# EasyEDA Pro project 2022-SS-ZT-2.eprj

# Schematic EDA_LQ_13P_P278
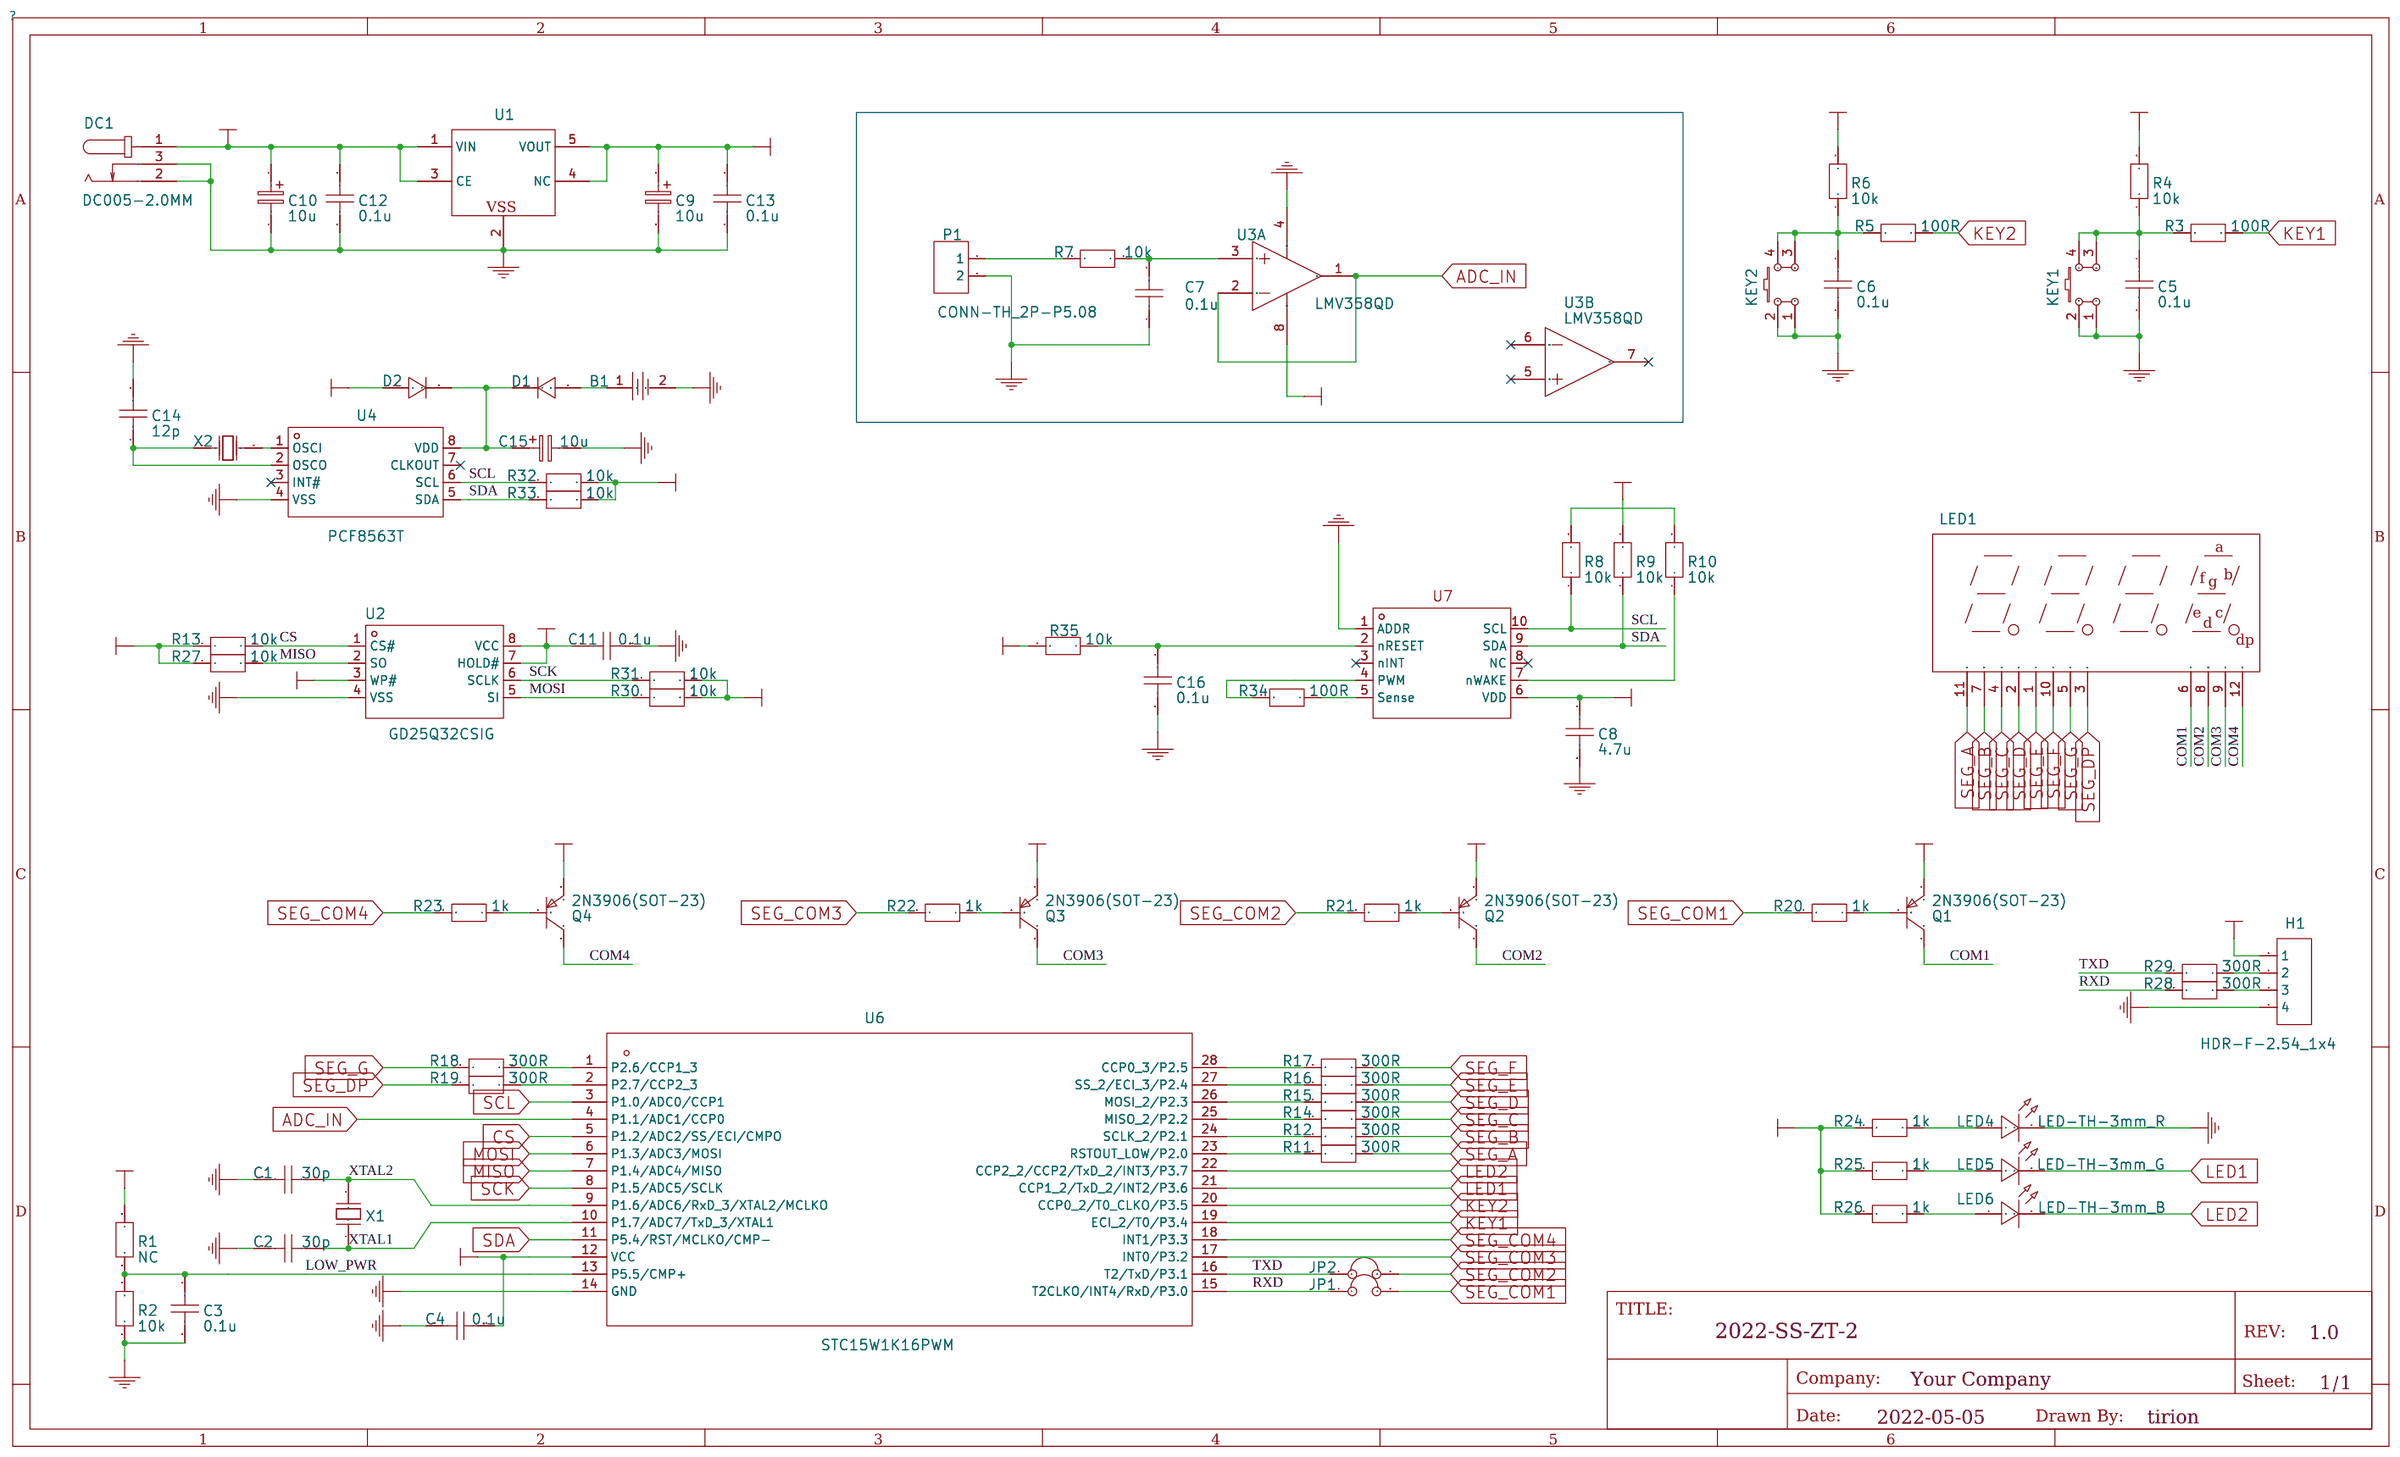
[diagram p0: schematic sheet]

## Parts
B1  CR1220-2  [BAT-SMD_CR1220-2]
C1  30p  [C0805]
C2  30p  [C0805]
C3  0.1u  [C0805]
C4  0.1u  [C0805]
C5  0.1u  [C0805]
C6  0.1u  [C0805]
C7  0.1u  [C0805]
C8  4.7u  [C0805]
C9  10u  [CAP-D5.0×H5.5]
C10  10u  [CAP-D5.0×H5.5]
C11  0.1u  [C0805]
C12  0.1u  [C0805]
C13  0.1u  [C0805]
C14  12p  [C0805]
C15  10u  [CAP-D5.0×H5.5]
C16  0.1u  [C0805]
D1  1N4148  [DO-35_BD2.0-L4.2-P8.20-D0.5-RD]
D2  1N4148  [DO-35_BD2.0-L4.2-P8.20-D0.5-RD]
DC1  DC005-2.0MM  [DC-IN-TH_DC005]
H1  HDR-F-2.54_1x4  [HDR-F-2.54_1X4]
JP1  跳线  [JUMPER2]
JP2  跳线  [JUMPER2]
KEY1  K4-6×6_SMD  [KEY-SMD_4P-L6.0-W6.0-P3.90-LS10.0]
KEY2  K4-6×6_SMD  [KEY-SMD_4P-L6.0-W6.0-P3.90-LS10.0]
LED1  0.36寸4位数码管  [LED-SEG-TH_FJ5461AH]
LED4  LED-TH-3mm_R  [LED-TH_BD3.0_RED]
LED5  LED-TH-3mm_G  [LED-TH_BD3.0_GREEN]
LED6  LED-TH-3mm_B  [LED-TH_BD3.0_BLUE]
P1  CONN-TH_2P-P5.08  [CONN-TH_2P-P5.08]
Q1  2N3906(SOT-23)  [SOT-23-3_L2.9-W1.6-P1.90-LS2.8-TR-CW]
Q2  2N3906(SOT-23)  [SOT-23-3_L2.9-W1.6-P1.90-LS2.8-TR-CW]
Q3  2N3906(SOT-23)  [SOT-23-3_L2.9-W1.6-P1.90-LS2.8-TR-CW]
Q4  2N3906(SOT-23)  [SOT-23-3_L2.9-W1.6-P1.90-LS2.8-TR-CW]
R1  NC  [R0805]
R2  10k  [R0805]
R3  100R  [R0805]
R4  10k  [R0805]
R5  100R  [R0805]
R6  10k  [R0805]
R7  10k  [R0805]
R8  10k  [R0805]
R9  10k  [R0805]
R10  10k  [R0805]
R11  300R  [R0805]
R12  300R  [R0805]
R13  10k  [R0805]
R14  300R  [R0805]
R15  300R  [R0805]
R16  300R  [R0805]
R17  300R  [R0805]
R18  300R  [R0805]
R19  300R  [R0805]
R20  1k  [R0805]
R21  1k  [R0805]
R22  1k  [R0805]
R23  1k  [R0805]
R24  1k  [R0805]
R25  1k  [R0805]
R26  1k  [R0805]
R27  10k  [R0805]
R28  300R  [R0805]
R29  300R  [R0805]
R30  10k  [R0805]
R31  10k  [R0805]
R32  10k  [R0805]
R33  10k  [R0805]
R34  100R  [R0805]
R35  10k  [R0805]
U1  XC6210A252M  [SOT-25_L2.9-W1.6-P0.95-LS2.8-BL]
U2  GD25Q32CSIG  [SOP-8_L5.3-W5.3-P1.27-LS8.0-BL]
U3  LMV358QD  [SOIC-8_L4.9-W3.9-P1.27-LS6.0-BL]  (sections 1,2)
U4  PCF8563T  [SOIC-8_L5.0-W4.0-P1.27-LS6.0-BL]
U6  STC15W1K16PWM  [SOP-28_L17.9-W7.5-P1.27-LS10.3-BL]
U7  SOIC-10  [IC-10]
X1  12MHZ  [OSC-49U-1]
X2  32.768KHz  [XTAL-DT38]

## Library data of the parts
B1 = CR1220-2: Supplier: LCSC; Manufacturer: Q&amp;J; Supplier Part: C70381; JLCPCB Part Class: Extended Part
C1 C2 = 30p
C3-C7 C11-C13 C16 = 0.1u
C8 = 4.7u
C9 C10 C15 = 10u
C14 = 12p
D1 D2 = 1N4148: Supplier: LCSC; Supplier Part: C13769; Manufacturer: STMicroelectronics
DC1 = DC005-2.0MM: Supplier: LCSC; Manufacturer: SOFNG; Supplier Part: C111567
H1 = HDR-F-2.54_1x4: Supplier Part: C225501; Supplier: LCSC
JP1 JP2 = 跳线
KEY1 KEY2 = K2-6639SP-D4SC-04: Supplier Part: C191626; Supplier: LCSC; Manufacturer: 韩国韩荣
LED1 = FJ5461BH 纯红: Supplier: LCSC; Manufacturer: ReliaPro; Supplier Part: C38183
LED4 = 204-10SDRD/S530-A3-L: Manufacturer: EVERLIGHT(台湾亿光); Supplier Part: C84774; Supplier: LCSC
LED5 = 204-10SYGD/S530-E3: Manufacturer: EVERLIGHT(台湾亿光); Supplier Part: C85161
LED6 = 204-10SUBC/S400-A4: Manufacturer: EVERLIGHT(台湾亿光); Supplier Part: C86881; Supplier: LCSC
P1 = CONN-TH_2P-P5.08: Supplier: LCSC
Q1-Q4 = 2N3906S-RTK/PS: Supplier: LCSC; Manufacturer: KEC; Supplier Part: C147294
R1 = NC
R2 R4 R6-R10 R13 R27 R30-R33 R35 = 10k
R3 R5 R34 = 100R
R11 R12 R14-R19 R28 R29 = 300R
R20-R26 = 1k
U1 = XC6210A252M: Supplier: LCSC; Manufacturer: Torex Semicon
U2 = GD25Q32CSIG: Supplier: LCSC; Manufacturer: GigaDevice; Supplier Part: C79075; JLCPCB Part Class: Extended Part
U3 = LMV358QD: Supplier: LCSC; Supplier Part: C2859693; Manufacturer: TI(德州仪器); link: https://atta.szlcsc.comnull
U4 = PCF8563T/5,518: Supplier: LCSC; Manufacturer: NXP; Supplier Part: C7440; JLCPCB Part Class: Basic Part
U6 = STC15W1K16PWM: Supplier: LCSC; Manufacturer: STC; Supplier Part: C65670; JLCPCB Part Class: Extended Part
U7 = SOIC-10
X1 = X49UD12MSD2SC: Supplier Part: undefined; Supplier: LCSC; Manufacturer: LCSC
X2 = 6K832768F12UB: Supplier: LCSC; Supplier Part: C252404; Manufacturer: SHENZHEN CRYSTAL TECH

## Nets
GND: B1.2 C1.2 C2.2 C3.2 C4.2 C5.2 C6.2 C7.1 C8.2 C9.2 C10.2 C11.2 C12.2 C13.2 C14.1 C15.2 C16.2 DC1.2 DC1.3 H1.4 KEY1.1 KEY1.2 KEY2.1 KEY2.2 LED4.2 P1.2 R2.1 U1.2(VSS) U2.4(VSS) U3.4(GND) U4.4(VSS) U6.14(GND) U7.1(ADDR)
VDD: C4.1 C8.1 C9.1 C11.1 C13.1 D2.2 H1.1 Q1.1(E) Q2.1(E) Q3.1(E) Q4.1(E) R4.2 R6.2 R9.2 R13.1 R24.2 R25.2 R26.2 R27.1 R30.2 R31.2 R32.2 R33.2 R35.2 U1.4(NC) U1.5(VOUT) U2.3(WP#) U2.7(HOLD#) U2.8(VCC) U3.8(VCC+) U6.12(VCC) U7.6(VDD)
ADC_IN: U3.1(OUT) U3.2(1IN-) U6.4(P1.1/ADC1/CCP0)
COM1: LED1.6(DIG4) Q1.3(C)
COM2: LED1.8(DIG3) Q2.3(C)
COM3: LED1.9(DIG2) Q3.3(C)
COM4: LED1.12(DIG1) Q4.3(C)
CS: R13.2 U2.1(CS#) U6.5(P1.2/ADC2/SS/ECI/CMPO)
DC: C10.1 C12.1 DC1.1 R1.2 U1.1(VIN) U1.3(CE)
KEY1: R3.1 U6.19(ECI_2/T0/P3.4)
KEY2: R5.1 U6.20(CCP0_2/T0_CLKO/P3.5)
LED1: LED5.2 U6.21(CCP1_2/TxD_2/INT2/P3.6)
LED2: LED6.2 U6.22(CCP2_2/CCP2/TxD_2/INT3/P3.7)
LOW_PWR: C3.1 R1.1 R2.2 U6.13(P5.5/CMP+)
MISO: R27.2 U2.2(SO) U6.7(P1.4/ADC4/MISO)
MOSI: R30.1 U2.5(SI) U6.6(P1.3/ADC3/MOSI)
RXD: JP1.1 R28.2 U6.15(T2CLKO/INT4/RxD/P3.0)
SCK: R31.1 U2.6(SCLK) U6.8(P1.5/ADC5/SCLK)
SCL: R8.1 R32.1 U4.6(SCL) U6.3(P1.0/ADC0/CCP1) U7.10(SCL)
SDA: R9.1 R33.1 U4.5(SDA) U6.11(P5.4/RST/MCLKO/CMP-) U7.9(SDA)
SEG_A: LED1.11(A) R11.1
SEG_B: LED1.7(B) R12.1
SEG_C: LED1.4(C) R14.1
SEG_COM1: JP1.2 R20.2
SEG_COM2: JP2.2 R21.2
SEG_COM3: R22.2 U6.17(INT0/P3.2)
SEG_COM4: R23.2 U6.18(INT1/P3.3)
SEG_D: LED1.2(D) R15.1
SEG_DP: LED1.3(DP) R19.2
SEG_E: LED1.1(E) R16.1
SEG_F: LED1.10(F) R17.1
SEG_G: LED1.5(G) R18.2
TXD: JP2.1 R29.2 U6.16(T2/TxD/P3.1)
XTAL1: C2.1 U6.10(P1.7/ADC7/TxD_3/XTAL1) X1.1(OSC1)
XTAL2: C1.1 U6.9(P1.6/ADC6/RxD_3/XTAL2/MCLKO) X1.2(OSC2)
$1N209: C5.1 KEY1.3 KEY1.4 R3.2 R4.1
$1N230: C6.1 KEY2.3 KEY2.4 R5.2 R6.1
$1N364: R17.2 U6.28(CCP0_3/P2.5)
$1N365: R16.2 U6.27(SS_2/ECI_3/P2.4)
$1N366: R15.2 U6.26(MOSI_2/P2.3)
$1N367: R14.2 U6.25(MISO_2/P2.2)
$1N368: R12.2 U6.24(SCLK_2/P2.1)
$1N369: R11.2 U6.23(RSTOUT_LOW/P2.0)
$1N370: R19.1 U6.2(P2.7/CCP2_3)
$1N371: R18.1 U6.1(P2.6/CCP1_3)
$1N483: Q1.2(B) R20.1
$1N492: Q2.2(B) R21.1
$1N524: Q3.2(B) R22.1
$1N556: Q4.2(B) R23.1
$1N635: LED5.1 R25.1
$1N636: LED6.1 R26.1
$1N802: H1.3 R28.1
$1N805: H1.2 R29.1
$1N952: B1.1 D1.2
$1N955: C15.1 D1.1 D2.1 U4.8(VDD)
$1N968: U4.1(OSCI) X2.2(OSC2)
$1N969: C14.2 U4.2(OSCO) X2.1(OSC1)
$1N1047: LED4.1 R24.1
$1N1134: R34.1 U7.5(Sense)
$1N1144: R34.2 U7.4(PWM)
$1N1149: R8.2 R10.2
$1N1177: R10.1 U7.7(nWAKE)
$1N1209: C16.1 R35.1 U7.2(nRESET)
$1N3634: P1.1 R7.2
$1N3652: C7.2 R7.1 U3.3(1IN+)

Not connected (* = marked no-connect by the designer): U3 5(2IN+)* 6(2IN-)* 7(2OUT)*; U4 3(INT#)* 7(CLKOUT)*; U7 3(nINT)* 8(NC)*

# Board PCB
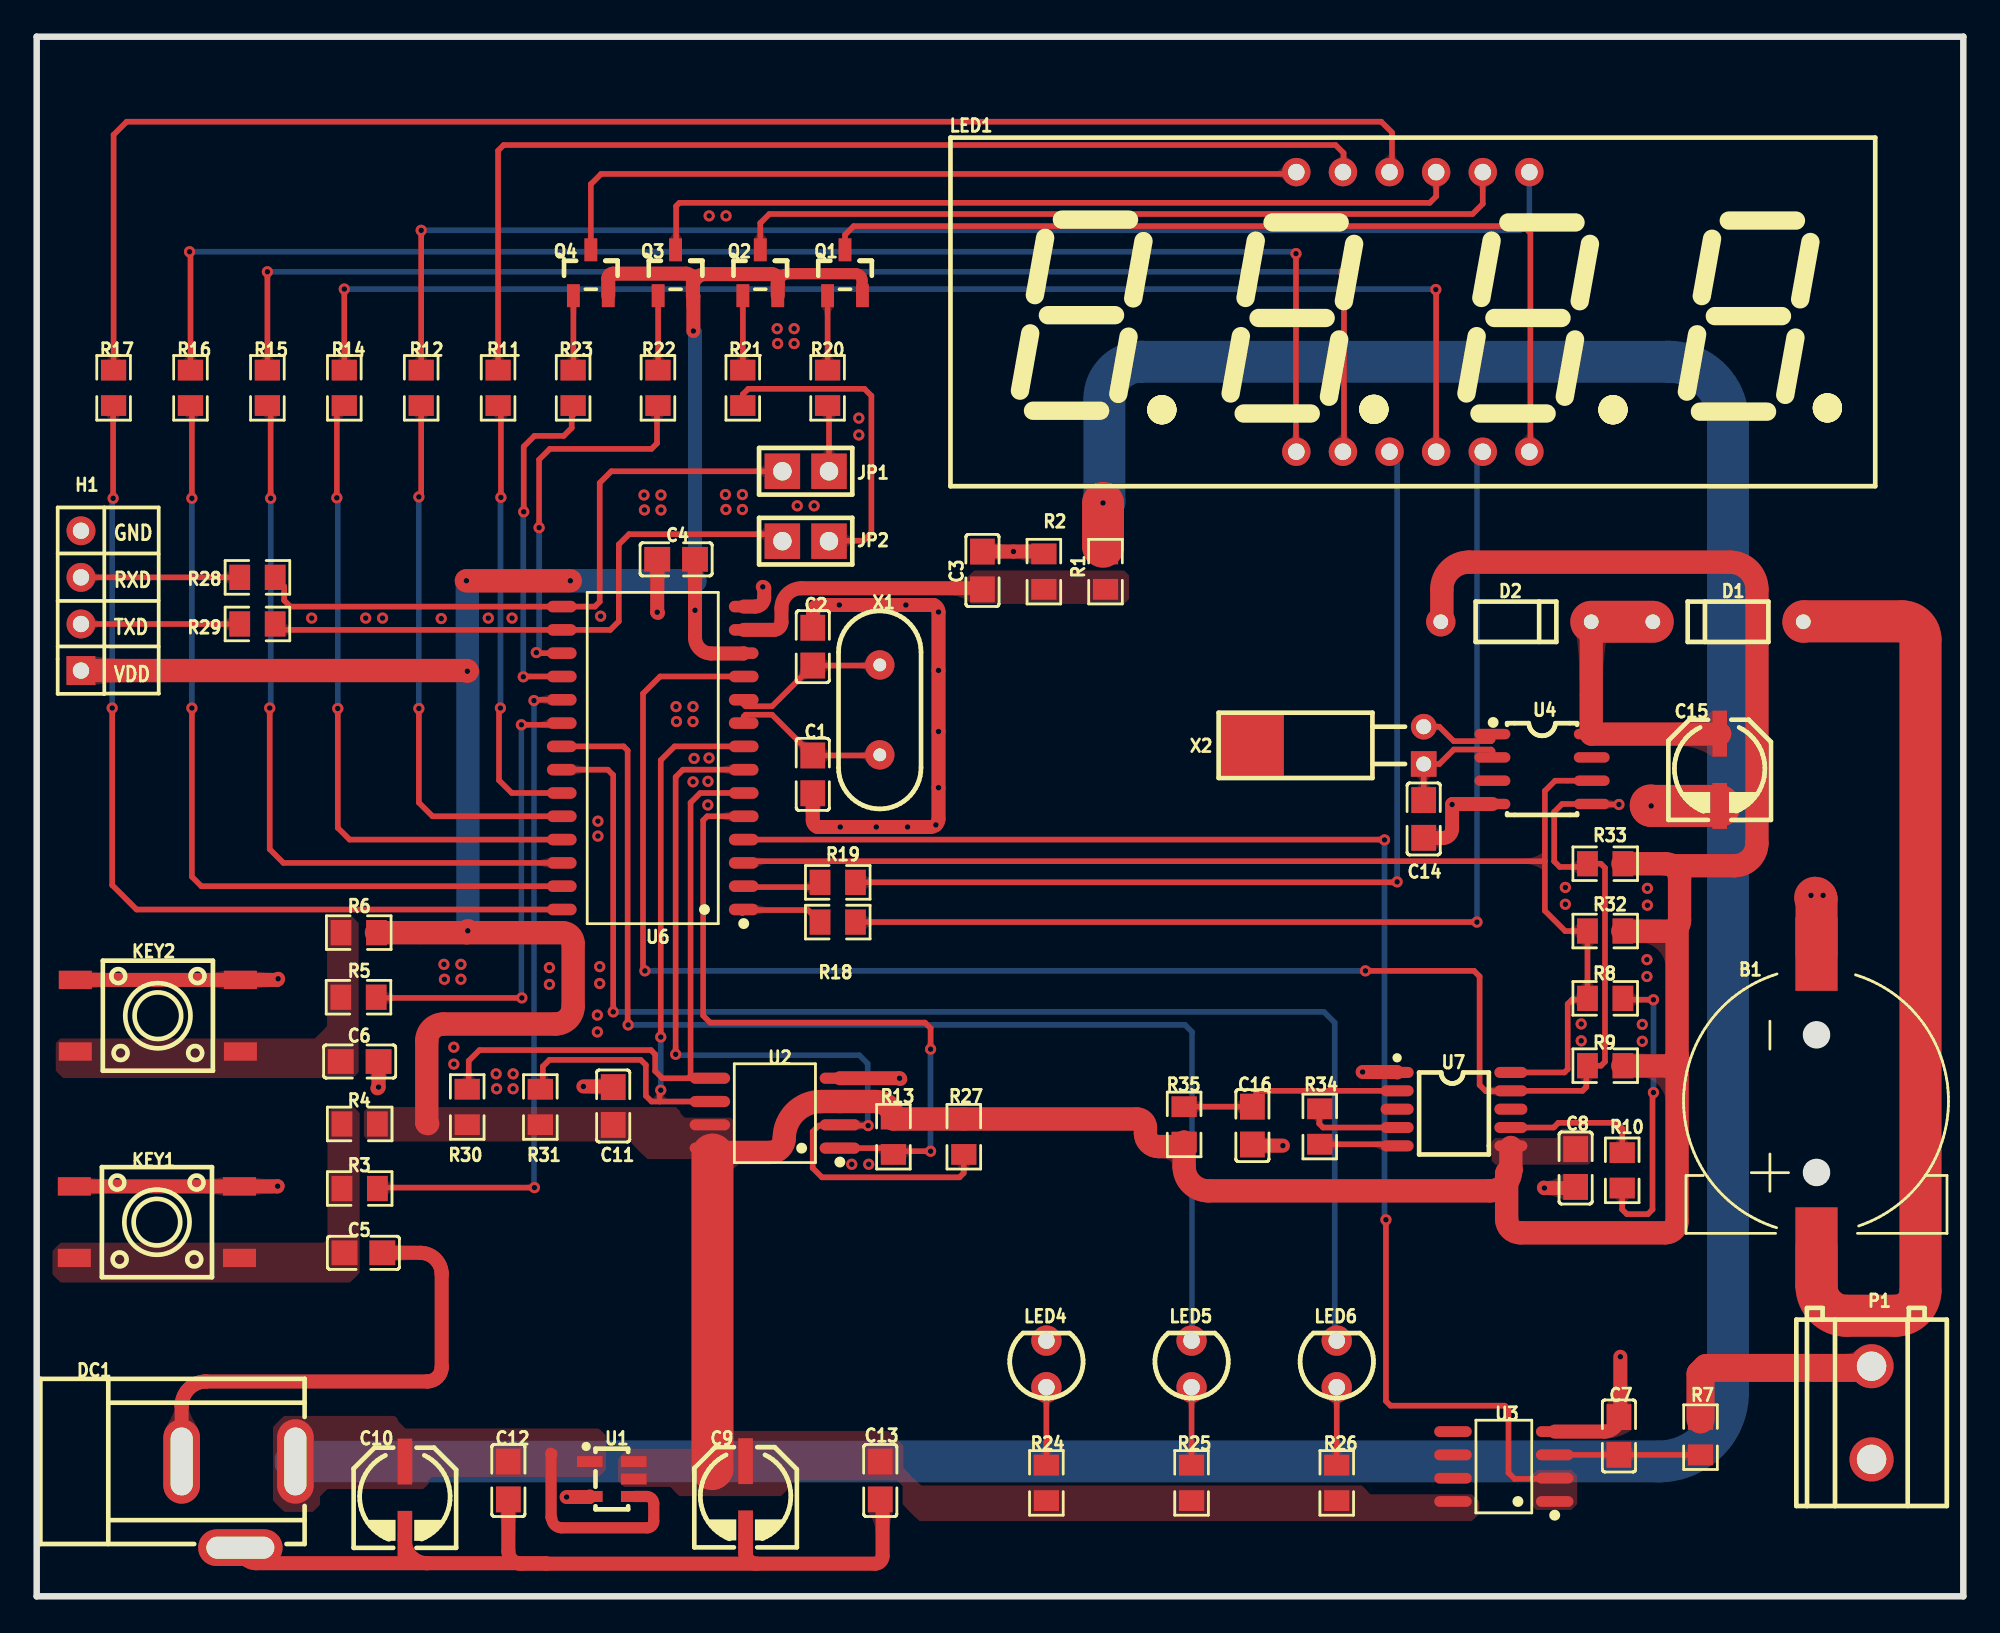
[diagram p1: board, top side]
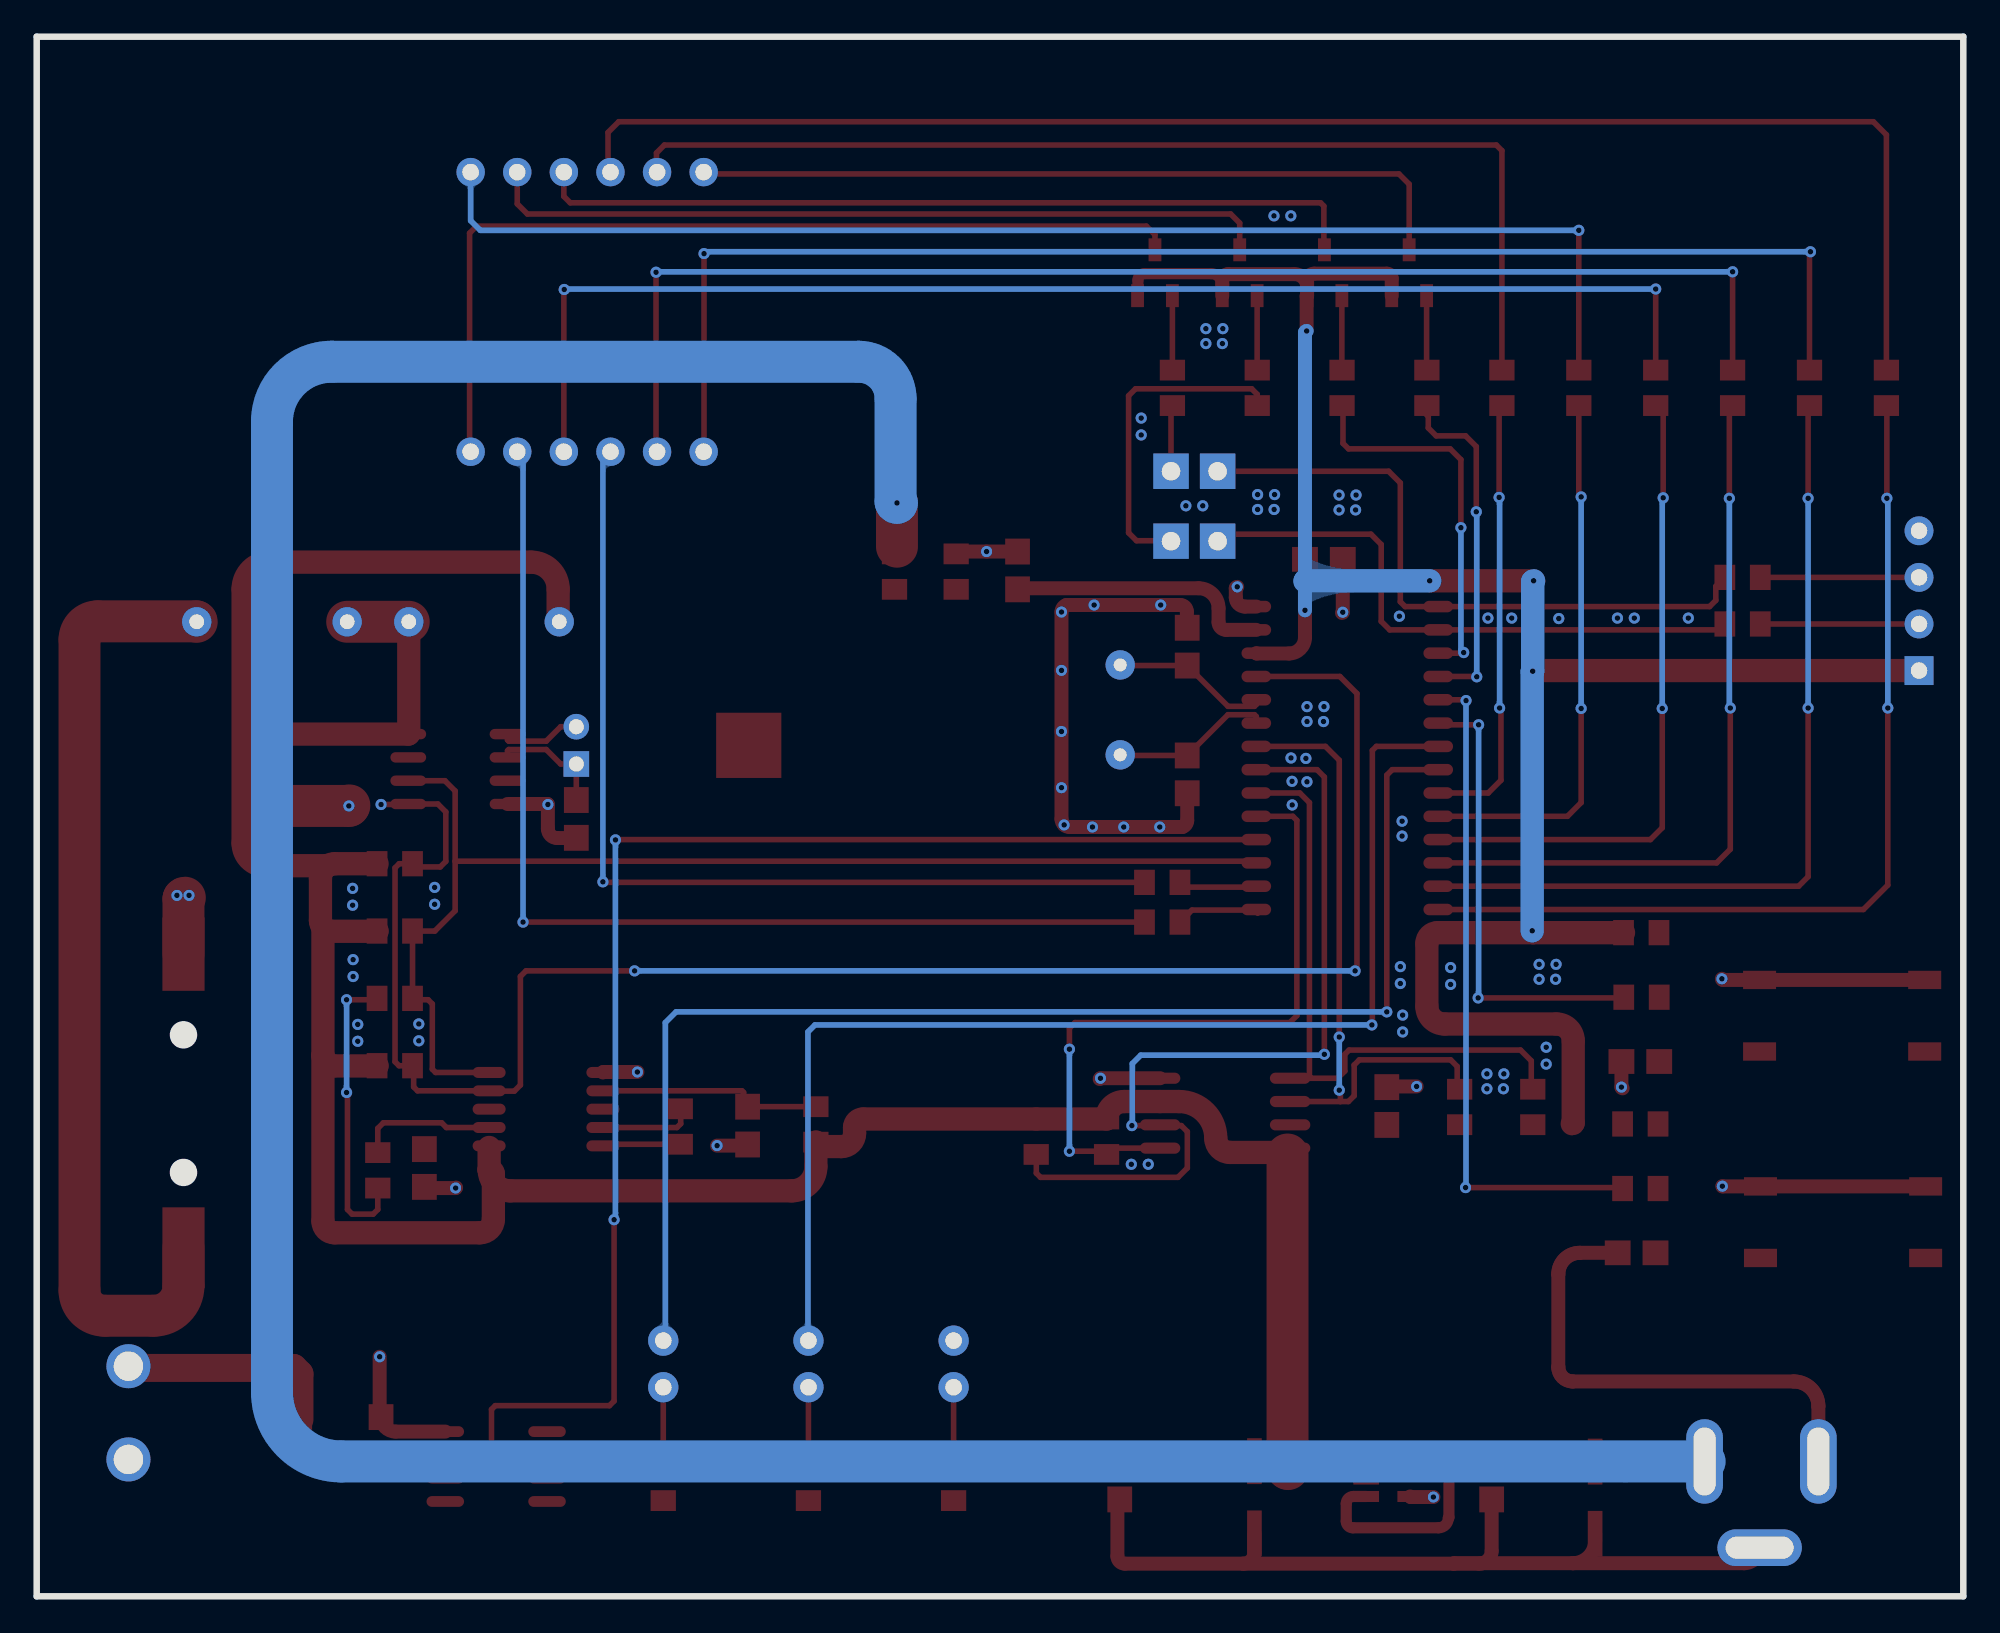
[diagram p2: board, bottom side, seen from below]

Outline 105 x 85 mm; copper layers: Top Layer, Bottom Layer. Coordinates in mm from the lower left corner of the outline.
Outline path: 0,85 105,85 105,0 0,0 0,85
Stack: Top Layer 0.035mm / Dielectric1 1.51mm FR4 er 4.5 / Bottom Layer 0.035mm

## Design rules (mm)
net XTAL2: DP2
net XTAL1: DP2
net $1N968: DP1
net $1N969: DP1
template: 用户自定义配置
spacing Default (default): track to track 0.152, other pairs 0 to 0.152
track width Default (default): min 0.305, default 0.305, max 25.4
track width PWR: min 0.305, default 0.61, max 2.54
differential pair differentialPair (default): width min 0.305, default 0.305, max 2.54; gap min 0.152, default 0.152
via Default (default): diameter min 0.61, default 0.61, max 100.025; hole min 0.305, default 0.305, max 59.995
net VDD uses PWR
net GND uses PWR
net DC uses PWR

## Placement (name value [footprint] x y rotation side)
B1  CR1220-2  [BAT-SMD_CR1220-2]  97 27 90 top
C1  30p  [C0805]  42.3 44.8 270 top
C2  30p  [C0805]  42.3 51.76 90 top
C3  0.1u  [C0805]  51.54 55.91 90 top
C4  0.1u  [C0805]  34.85 56.52 180 top
C5  0.1u  [C0805]  17.81 18.72 0 top
C6  0.1u  [C0805]  17.6 29.15 0 top
C7  0.1u  [C0805]  86.23 8.74 270 top
C8  4.7u  [C0805]  83.87 23.34 270 top
C9  10u  [CAP-D5.0×H5.5]  38.63 3.43 90 top
C10  10u  [CAP-D5.0×H5.5]  20.07 3.4 90 top
C11  0.1u  [C0805]  31.42 26.72 90 top
C12  0.1u  [C0805]  25.7 6.31 270 top
C13  0.1u  [C0805]  45.97 6.31 270 top
C14  12p  [C0805]  75.59 42.37 90 top
C15  10u  [CAP-D5.0×H5.5]  91.72 43.08 90 top
C16  0.1u  [C0805]  66.26 25.65 270 top
D1  1N4148  [DO-35_BD2.0-L4.2-P8.20-D0.5-RD]  92.18 53.11 0 top
D2  1N4148  [DO-35_BD2.0-L4.2-P8.20-D0.5-RD]  80.62 53.11 180 top
DC1  DC005-2.0MM  [DC-IN-TH_DC005]  11 5 0 top
H1  HDR-F-2.54_1x4  [HDR-F-2.54_1X4]  2.41 54.26 90 top
JP1  跳线  [JUMPER2]  41.91 61.32 180 top
JP2  跳线  [JUMPER2]  41.91 57.51 180 top
KEY1  K4-6×6_SMD  [KEY-SMD_4P-L6.0-W6.0-P3.90-LS10.0]  6.55 20.39 0 top
KEY2  K4-6×6_SMD  [KEY-SMD_4P-L6.0-W6.0-P3.90-LS10.0]  6.6 31.64 0 top
LED1  0.36寸4位数码管  [LED-SEG-TH_FJ5461AH]  75 70 0 top
LED4  LED-TH-3mm_R  [LED-TH_BD3.0_RED]  55.03 12.66 180 top
LED5  LED-TH-3mm_G  [LED-TH_BD3.0_GREEN]  62.94 12.66 180 top
LED6  LED-TH-3mm_B  [LED-TH_BD3.0_BLUE]  70.85 12.66 180 top
P1  -  [CONN-TH_2P-P5.08]  100 10 270 top
Q1  2N3906(SOT-23)  [SOT-23-3_L2.9-W1.6-P1.90-LS2.8-TR-CW]  44.05 72.14 270 top
Q2  2N3906(SOT-23)  [SOT-23-3_L2.9-W1.6-P1.90-LS2.8-TR-CW]  39.44 72.14 270 top
Q3  2N3906(SOT-23)  [SOT-23-3_L2.9-W1.6-P1.90-LS2.8-TR-CW]  34.82 72.14 270 top
Q4  2N3906(SOT-23)  [SOT-23-3_L2.9-W1.6-P1.90-LS2.8-TR-CW]  30.2 72.14 270 top
R1  NC  [R0805]  58.25 55.85 90 top
R2  10k  [R0805]  54.89 55.85 270 top
R3  100R  [R0805]  17.6 22.22 180 top
R4  10k  [R0805]  17.6 25.74 0 top
R5  100R  [R0805]  17.54 32.65 180 top
R6  10k  [R0805]  17.55 36.17 0 top
R7  10k  [R0805]  90.68 8.67 90 top
R8  10k  [R0805]  85.48 32.59 0 top
R9  10k  [R0805]  85.48 28.92 0 top
R10  10k  [R0805]  86.41 23.22 270 top
R11  300R  [R0805]  25.15 65.86 270 top
R12  300R  [R0805]  20.95 65.86 270 top
R13  10k  [R0805]  46.69 25.05 270 top
R14  300R  [R0805]  16.76 65.86 270 top
R15  300R  [R0805]  12.57 65.86 270 top
R16  300R  [R0805]  8.38 65.86 270 top
R17  300R  [R0805]  4.19 65.86 270 top
R18  300R  [R0805]  43.66 36.75 0 top
R19  300R  [R0805]  43.66 38.91 0 top
R20  1k  [R0805]  43.1 65.86 270 top
R21  1k  [R0805]  38.48 65.86 270 top
R22  1k  [R0805]  33.86 65.86 270 top
R23  1k  [R0805]  29.24 65.86 270 top
R24  1k  [R0805]  55.03 6.18 270 top
R25  1k  [R0805]  62.94 6.18 270 top
R26  1k  [R0805]  70.85 6.18 270 top
R27  10k  [R0805]  50.53 25.05 270 top
R28  300R  [R0805]  12.03 55.53 0 top
R29  300R  [R0805]  12.03 52.99 0 top
R30  10k  [R0805]  23.46 26.67 270 top
R31  10k  [R0805]  27.45 26.67 270 top
R32  10k  [R0805]  85.48 36.26 0 top
R33  10k  [R0805]  85.48 39.93 0 top
R34  100R  [R0805]  69.93 25.6 90 top
R35  10k  [R0805]  62.53 25.72 270 top
U1  XC6210A252M  [SOT-25_L2.9-W1.6-P0.95-LS2.8-BL]  31.34 6.39 270 top
U2  GD25Q32CSIG  [SOP-8_L5.3-W5.3-P1.27-LS8.0-BL]  40.23 26.33 90 top
U3  LMV358QD  [SOIC-8_L4.9-W3.9-P1.27-LS6.0-BL]  79.96 7.07 90 top
U4  PCF8563T  [SOIC-8_L5.0-W4.0-P1.27-LS6.0-BL]  82.04 45.09 270 top
U6  STC15W1K16PWM  [SOP-28_L17.9-W7.5-P1.27-LS10.3-BL]  33.57 45.69 90 top
U7  SOIC-10  [IC-10]  74.14 28.55 270 top
X1  12MHZ  [OSC-49U-1]  45.95 48.31 0 top
X2  32.768KHz  [XTAL-DT38]  75.59 45.36 270 top

## Footprints (pads in the part's own frame, mm; a bottom-side part is the same pattern mirrored in y, then rotated)
BAT-SMD_CR1220-2
  rect 4.4x2.3 smd: 1(-8,0)
  rect 4x2.3 smd: 2(8,0)
C0805
  rect 1.41x1.35 smd: 1(-1.03,0) 2(1.03,0)
CAP-D5.0×H5.5
  rect 2.5x0.8 smd: 1(3.937,0) 2(0,0)
CONN-TH_2P-P5.08
  round 2.4 hole 1.6: 1(-2.54,0) 2(2.54,0)
DC-IN-TH_DC005
  oval 2x4.6 hole 1.2x3.7: 1(3.1,2.35) 2(-3.1,2.35)
  oval 4.6x2 hole 3.7x1.2: 3(0.1,-2.35)
DO-35_BD2.0-L4.2-P8.20-D0.5-RD
  round 1.6 hole 0.8: 1(-4.1,0) 2(4.1,0)
HDR-F-2.54_1X4
  rect 1.575x1.575 hole 0.889: 1(-3.81,0)
  round 1.575 hole 0.889: 2(-1.27,0) 3(1.27,0) 4(3.81,0)
IC-10
  oval 0.6x1.8 smd: 1(0,0) 2(1,0) 3(2,0) 4(3,0) 5(4,0) 6(4,6.2) 7(3,6.2) 8(2,6.2) 9(1,6.2) 10(0,6.2)
JUMPER2
  rect 1.931x1.931 hole 1.001x1.006: 1(1.27,0) 2(-1.27,0)
KEY-SMD_4P-L6.0-W6.0-P3.90-LS10.0
  rect 1.8x1 smd: 1(-4.5,1.95) 2(4.5,1.95) 3(-4.5,-1.95) 4(4.5,-1.95)
LED-SEG-TH_FJ5461AH
  round 1.55 hole 0.9: 1(-6.35,-7.62) 2(-3.81,-7.62) 3(-1.27,-7.62) 4(1.27,-7.62) 5(3.81,-7.62) 6(6.35,-7.62) 7(6.35,7.62) 8(3.81,7.62) 9(1.27,7.62) 10(-1.27,7.62) 11(-3.81,7.62) 12(-6.35,7.62)
LED-TH_BD3.0_BLUE
  round 1.651 hole 0.9: 1(0,1.27) 2(0,-1.27)
LED-TH_BD3.0_GREEN
  round 1.651 hole 0.9: 1(0,1.27) 2(0,-1.27)
LED-TH_BD3.0_RED
  round 1.651 hole 0.9: 1(0,1.27) 2(0,-1.27)
OSC-49U-1
  round 1.6 hole 0.7: 1(0,2.45) 2(0,-2.45)
R0805
  rect 1.133x1.377 smd: 1(-0.966,0) 2(0.966,0)
SOIC-8_L4.9-W3.9-P1.27-LS6.0-BL
  oval 0.588x2.045 smd: 1(-1.905,-2.772) 2(-0.635,-2.772) 3(0.635,-2.772) 4(1.905,-2.772) 5(1.905,2.772) 6(0.635,2.772) 7(-0.635,2.772) 8(-1.905,2.772)
SOIC-8_L5.0-W4.0-P1.27-LS6.0-BL
  oval 0.569x1.95 smd: 1(-1.905,-2.705) 2(-0.635,-2.705) 3(0.635,-2.705) 4(1.905,-2.705) 5(1.905,2.705) 6(0.635,2.705) 7(-0.635,2.705) 8(-1.905,2.705)
SOP-8_L5.3-W5.3-P1.27-LS8.0-BL
  oval 0.609x2.204 smd: 1(-1.905,-3.542) 2(-0.635,-3.542) 3(0.635,-3.542) 4(1.905,-3.542) 5(1.905,3.542) 6(0.635,3.542) 7(-0.635,3.542) 8(-1.905,3.542)
SOP-28_L17.9-W7.5-P1.27-LS10.3-BL
  oval 0.63x1.615 smd: 1(-8.255,-4.957) 2(-6.985,-4.957) 3(-5.715,-4.957) 4(-4.445,-4.957) 5(-3.175,-4.957) 6(-1.905,-4.957) 7(-0.635,-4.957) 8(0.635,-4.957) 9(1.905,-4.957) 10(3.175,-4.957) 11(4.445,-4.957) 12(5.715,-4.957) 13(6.985,-4.957) 14(8.255,-4.957) 15(8.255,4.957) 16(6.985,4.957) 17(5.715,4.957) 18(4.445,4.957) 19(3.175,4.957) 20(1.905,4.957) 21(0.635,4.957) 22(-0.635,4.957) 23(-1.905,4.957) 24(-3.175,4.957) 25(-4.445,4.957) 26(-5.715,4.957) 27(-6.985,4.957) 28(-8.255,4.957)
SOT-23-3_L2.9-W1.6-P1.90-LS2.8-TR-CW
  rect 1.25x0.7 smd: 1(1.25,0.95) 2(1.25,-0.95) 3(-1.25,0)
SOT-25_L2.9-W1.6-P0.95-LS2.8-BL
  rect 0.6x1.4 smd: 1(-0.95,-1.2) 2(0.95,-1.2) 3(0.95,1.2) 4(0,1.2) 5(-0.95,1.2)
XTAL-DT38
  rect 3.556x3.556 smd: 0(-1.016,-9.398)
  rect 1.397x1.397 hole 0.818x0.813: 1(0,0)
  round 1.397 hole 0.818x0.813: 2(-2.032,0)

## Nets
As in the schematic.

Pads without a net: U3 5 6 7; U4 3 7; U7 3 8; X2 0

## Via types
v1: diameter 0.61, hole 0.305, Top Layer to Bottom Layer, 142 vias

## Routing (per net, layer and track width the routed paths; a pad name or vN(x,y) marks a point on that pad's centre or on a via; arc(x,y) is an arc through that point)
GND: length 172.5
  Top Layer w0.762: 27.78,1.78 26.39,1.78 arc(26.3,1.78) 26.21,1.8 ; 27.78,1.78 39.24,1.78 ; 27.78,1.78 arc(27.77,1.8) 27.75,1.8 26.21,1.8 ; C6.2 v1(18.63,27.75) arc(18.61,27.71) 18.57,27.69 ; C12.2 25.7,2.46 arc(25.84,2.05) 26.21,1.8 ; 7.9,10.36 7.9,7.35 ; 7.9,10.36 arc(8.29,11.32) 9.25,11.71 ; 7.9,10.36 arc(8.29,11.32) 9.25,11.71 ; U3.4 85.44,8.98 arc(86,9.21) C7.1 arc(86.29,9.79) 86.31,9.84 v1(86.31,13.06) ; v1(28.88,5.41) 30.11,5.41 arc(30.13,5.42) U1.2 ; 21.28,11.71 9.25,11.71 ; 21.28,11.71 arc(21.84,11.94) 22.07,12.5 ; 21.28,11.71 arc(21.84,11.94) 22.07,12.5 ; 21.28,1.8 26.21,1.8 ; 21.28,1.8 11.95,1.8 arc(11.35,2.05) DC1.3 ; 21.28,1.8 arc(20.42,2.16) 20.07,3.02 C10.2 ; v1(67.92,24.56) 66.32,24.56 arc(66.27,24.58) C16.2 ; v1(29.79,27.79) 31.38,27.79 arc(31.41,27.78) C11.2 ; KEY2.1 KEY2.2 13.09,33.59 arc(13.14,33.61) v1(13.16,33.66) ; C4.2 v1(33.82,53.63) arc(33.83,53.61) 33.86,53.59 ; 39.24,1.78 45.69,1.78 arc(45.98,1.9) 46.1,2.18 46.1,5.15 arc(46.06,5.24) C13.2 ; 39.24,1.78 arc(38.81,1.96) 38.63,2.39 C9.2 ; U6.14 39.16,53.94 arc(39.51,54.08) 39.65,54.43 39.65,54.94 arc(39.63,54.99) v1(39.57,55.02) ; C5.2 20.9,18.72 ; 20.9,18.72 arc(21.73,18.38) 22.07,17.55 ; 20.9,18.72 arc(21.73,18.38) 22.07,17.55 ; C1.2 42.3,42.28 arc(42.37,42.06) 42.56,41.93 v1(43.79,41.93) v1(45.76,41.93) v1(47.46,41.93) 48.71,41.93 arc(48.87,41.96) v1(49,42.04) arc(49.11,42.19) 49.15,42.37 v1(49.15,44.07) v1(49.15,47.13) v1(49.15,50.46) v1(49.15,53.64) arc(49.08,53.88) 48.88,54.03 v1(47.37,54.03) v1(43.74,54.03) 42.67,54.03 arc(42.42,53.92) 42.32,53.67 42.32,52.81 arc(42.31,52.79) C2.2 ; 22.07,17.55 22.07,12.5 ; v1(72.26,28.58) 74.12,28.58 arc(74.14,28.57) U7.1 ; KEY1.1 KEY1.2 13.12,22.34 arc(13.13,22.34) v1(13.13,22.35) ; C3.2 v1(53.23,56.94) 54.76,56.94 arc(54.85,56.9) R2.1 ; U2.4 v1(47.03,28.23) arc(47.05,28.22) 47.07,28.19 ; U4.4 77.17,43.18 arc(77.15,43.17) v1(77.14,43.15) 77.14,41.83 arc(76.99,41.47) 76.63,41.33 75.6,41.33 arc(75.59,41.33) C14.1 ; 82.14,22.28 arc(82.15,22.26) v1(82.17,22.25) 83.81,22.25 arc(83.85,22.27) C8.2
  Top Layer w2.286: B1.2 97,38 arc(97,38.02) 96.99,38.03 arc(96.97,38.06) 96.93,38.07 ; C15.2 v1(87.99,43.08) arc(87.97,43.08) 87.96,43.1
  vias: v1(14.99,53.31) v1(17.93,53.31) v1(18.85,53.31) v1(22.05,53.29) v1(22.19,34.44) v1(22.22,33.63) v1(22.73,29.92) v1(22.73,29) v1(23.12,34.44) v1(23.12,33.63) v1(24.61,53.31) v1(25.04,28.47) v1(25.06,27.66) v1(25.91,53.31) v1(25.96,28.47) v1(25.96,27.66) v1(27.94,34.27) v1(27.94,33.35) v1(30.59,42.25) v1(30.59,41.43) v1(30.56,31.68) v1(30.56,30.76) v1(30.73,53.42) v1(30.68,34.32) v1(30.68,33.4) v1(33.1,60.02) v1(33.12,59.21) v1(34.02,60.02) v1(34.02,59.21) v1(34.84,48.49) v1(34.87,47.68) v1(35.77,48.49) v1(35.77,47.68) v1(35.83,45.67) v1(35.77,44.39) v1(36.65,75.23) v1(36.64,45.69) v1(36.58,44.42) v1(36.58,43.13) v1(37.54,60.05) v1(37.57,75.23) v1(37.56,59.23) v1(38.46,60.05) v1(38.46,59.23) v1(40.36,69.09) v1(40.38,68.28) v1(41.28,69.09) v1(41.28,68.28) v1(41.45,59.43) v1(42.37,59.43) v1(44.42,23.55) v1(44.81,64.21) v1(44.81,63.29) v1(45.34,23.55) v1(83.31,38.64) v1(83.31,37.72) v1(84.18,31.19) v1(84.18,30.27) v1(87.5,31.17) v1(87.5,30.25) v1(87.78,38.58) v1(87.78,37.67) v1(87.76,34.7) v1(87.76,33.78) v1(96.7,38.2) v1(97.36,38.2)
VDD: length 274.4
  Top Layer w0.61: U2.8 36.69,24.19 arc(36.59,23.95) 36.35,23.85 ; 40.39,71.48 arc(40.56,71.91) 41,72.08 44.63,72.08 arc(44.88,71.98) 44.98,71.73 44.98,70.91 arc(44.99,70.89) Q1.1
  Top Layer w0.762: 35.76,71.37 35.76,71.7 arc(35.65,71.97) 35.38,72.08 31.42,72.08 arc(31.23,72.01) 31.15,71.82 Q4.1 ; 35.76,71.37 35.76,70.89 arc(35.76,70.89) Q3.1 arc(35.78,70.88) 35.79,70.87 v1(35.79,68.96) ; 35.76,71.37 arc(35.96,71.86) 36.45,72.06 40.06,72.06 arc(40.29,71.96) 40.39,71.73 Q2.1 ; C4.1 v1(35.88,53.74) 35.88,52.26 arc(36.14,51.64) 36.75,51.38 38.51,51.38 arc(38.53,51.39) 38.53,51.4
  Top Layer w1.27: R6.2 23.44,36.17 ; 23.44,36.17 28.65,36.17 arc(29.06,36) 29.24,35.59 29.24,32.16 arc(28.95,31.47) 28.27,31.19 22.17,31.19 arc(21.53,30.92) 21.26,30.28 21.26,25.81 arc(21.27,25.77) 21.31,25.76 ; 23.44,36.17 arc(23.5,36.21) v1(23.5,36.27) ; 80.11,22.56 80.11,23.01 arc(80.18,23.18) 80.34,23.24 ; 80.11,22.56 80.11,20.55 arc(80.33,20.03) 80.85,19.81 88.77,19.81 arc(89.22,20) 89.4,20.44 89.4,29.48 ; 80.11,22.56 arc(80.28,22.88) 80.34,23.24 arc(80.34,23.24) 80.34,23.24 ; 80.11,22.56 arc(79.71,22.22) 79.2,22.1 63.86,22.1 arc(62.92,22.49) 62.53,23.42 R35.2 arc(62.46,24.58) 62.29,24.51 61.14,24.51 arc(60.63,24.72) 60.43,25.22 60.43,25.55 arc(60.29,25.88) 59.97,26.01 R27.1 R13.1 arc(46.41,26.69) 45.74,26.97 U2.3 42.74,26.97 arc(41.33,26.38) 40.74,24.97 arc(40.51,24.42) 39.97,24.19 36.69,24.19 ; 89.4,29.48 89.4,36.46 ; 89.4,29.48 arc(89.23,29.07) 88.82,28.91 86.46,28.91 arc(86.45,28.91) R9.2 ; R33.2 88.75,39.93 arc(88.96,39.9) 89.15,39.82 ; v1(23.42,55.35) v1(29.08,55.35) ; 80.34,23.24 80.34,24.46 ; 89.15,39.82 92.52,39.82 arc(93.39,40.18) 93.75,41.05 93.75,54.89 arc(93.32,55.93) 92.28,56.36 78.05,56.36 arc(77.01,55.93) 76.58,54.89 76.58,53.17 arc(76.56,53.13) D2.2 ; 89.15,39.82 arc(89.43,39.53) 89.53,39.14 89.53,36.83 arc(89.5,36.63) 89.4,36.46 ; 89.4,36.46 arc(89.2,36.3) 88.95,36.25 86.46,36.25 arc(86.45,36.25) R32.2 ; H1.1 23.44,50.45 arc(23.46,50.44) v1(23.47,50.42)
  Top Layer w2.286: 36.83,24.08 36.83,6.96 arc(36.82,6.94) 36.8,6.93
  Bottom Layer w0.762: v1(35.88,53.74) 35.88,68.87 arc(35.85,68.93) v1(35.79,68.96)
  Bottom Layer w1.27: v1(23.5,36.27) 23.5,50.39 arc(23.49,50.41) v1(23.47,50.42) 23.47,55.3 arc(23.45,55.33) v1(23.42,55.35) ; v1(29.08,55.35) 35.86,55.35 arc(35.87,55.34) 35.88,55.33
ADC_IN: length 78.5
  Top Layer w0.305: v1(73.53,20.52) 73.53,10.64 73.79,10.39 80.01,10.39 80.21,10.19 80.21,6.73 80.54,6.4 82.69,6.4 U3.2 ; v1(73.46,41.22) 73.44,41.24 38.53,41.24
  Bottom Layer w0.305: v1(73.53,20.52) 73.46,20.6 v1(73.46,41.22)
COM1: length 50.5
  Top Layer w0.305: LED1.6 81.41,62.44 81.41,74.3 81.03,74.68 44.53,74.68 44.05,74.2 Q1.3
COM2: length 43
  Top Layer w0.305: LED1.8 78.81,75.89 78.26,75.34 39.93,75.34 39.44,74.84 Q2.3
COM3: length 45.4
  Top Layer w0.305: LED1.9 76.27,76.3 75.92,75.95 35.03,75.95 34.85,75.77 34.85,73.42 Q3.3
COM4: length 42.3
  Top Layer w0.305: Q4.3 30.2,76.96 30.76,77.52 68.55,77.52 LED1.12
CS: length 37.5
  Top Layer w0.305: v1(48.72,24.26) 46.87,24.26 R13.2 arc(46.59,24.32) 46.35,24.42 U2.1 ; U6.5 36.54,42.51 36.32,42.29 36.32,31.65 36.7,31.27 48.41,31.27 48.72,30.96 v1(48.72,29.82)
  Bottom Layer w0.305: v1(48.72,29.82) v1(48.72,24.26)
DC: length 190.2
  Top Layer w0.61: U1.3 33.24,5.44 arc(33.52,5.33) 33.63,5.05 33.63,4.09 arc(33.53,3.84) 33.27,3.73 28.6,3.73 arc(28.22,3.89) 28.07,4.27 28.03,4.3 28.03,7.71 28.07,7.75 arc(28.05,7.78) 28.02,7.8
  Top Layer w2.286: v1(58.12,59.59) 58.12,57.2
  Bottom Layer w2.286: DC1.1 88.4,7.35 arc(91.07,8.46) 92.18,11.12 92.18,64.03 arc(91.22,66.33) 88.93,67.28 60.2,67.28 arc(58.78,66.7) 58.19,65.28 58.19,59.66 arc(58.17,59.61) v1(58.12,59.59)
KEY1: length 36.7
  Top Layer w0.305: v1(27.1,48.82) 27.14,48.86 U6.19 ; v1(27.13,22.28) 18.62,22.28 R3.1
  Bottom Layer w0.305: v1(27.1,48.82) 27.1,22.3 v1(27.13,22.28)
KEY2: length 25.1
  Top Layer w0.305: U6.20 28.52,47.5 v1(26.42,47.5) ; R5.1 18.54,32.61 v1(26.44,32.61)
  Bottom Layer w0.305: v1(26.44,32.61) 26.42,32.64 v1(26.42,47.5)
LED1: length 66.4
  Top Layer w0.305: v1(32.23,31.14) 32.21,31.17 32.21,46.1 31.99,46.32 28.62,46.32
  Bottom Layer w0.305: v1(32.23,31.14) 62.59,31.14 62.97,30.76 62.97,13.96 LED5.2
LED2: length 72.8
  Top Layer w0.305: v1(31.42,31.85) 31.42,44.75 31.12,45.05 U6.22
  Bottom Layer w0.305: v1(31.42,31.85) 70.16,31.85 70.74,31.27 70.74,14.05 LED6.2
LOW_PWR: length 14.7
  Top Layer w0.762: U6.13 40.17,52.67 arc(40.47,52.79) 40.59,53.09 40.59,53.85 arc(40.91,54.62) 41.68,54.94 51.48,54.94 arc(51.53,54.92) C3.1
MISO: length 47.8
  Top Layer w0.305: R27.2 50.52,24.07 50.52,23.06 50.29,22.83 42.8,22.83 42.29,23.34 42.29,25.32 42.62,25.65 43.73,25.65 U2.2 43.81,25.65 v1(45.31,25.65) ; v1(34.82,29.54) 34.82,44.65 35.22,45.05 U6.7
  Bottom Layer w0.305: v1(45.31,25.65) 45.29,25.68 45.29,29.03 44.83,29.49 34.87,29.49 v1(34.82,29.54)
MOSI: length 34.3
  Top Layer w0.305: R30.1 23.55,27.72 23.55,29.18 24.13,29.77 33.48,29.77 33.71,29.54 33.71,28.63 34.1,28.23 35.53,28.23 ; U6.6 36.16,43.78 35.64,43.26 35.64,28.34 35.53,28.23 ; 35.53,28.23 U2.5
RXD: length 35.6
  Top Layer w0.305: R28.2 13.49,55.04 13.49,54.28 13.83,53.94 U6.15 30.42,53.94 30.68,54.2 30.68,60.68 31.32,61.32 JP1.1
SCK: length 35.9
  Top Layer w0.305: 38.53,46.32 34.76,46.32 34.01,45.57 v1(34.01,30.48) ; v1(34.01,27.58) 33.95,27.52 33.95,26.97 ; 33.95,26.97 33.51,26.97 33.2,27.28 33.2,28.96 32.92,29.24 27.94,29.24 27.58,28.88 27.58,27.77 R31.1 ; 33.95,26.97 U2.6
  Bottom Layer w0.305: v1(34.01,30.48) v1(34.01,27.58)
SCL: length 67.4
  Top Layer w0.305: 82.19,40.06 38.88,40.06 38.79,39.97 U6.3 ; 82.19,40.06 82.19,37.36 83.3,36.26 R32.1 R8.1 84.44,32.51 83.67,32.51 83.44,32.28 83.44,28.73 83.26,28.55 U7.10 ; 82.19,40.06 82.19,43.89 82.75,44.45 U4.6
SDA: length 100.9
  Top Layer w0.305: v1(33.15,34.09) 33.05,34.19 33.05,49.2 33.98,50.13 U6.11 ; v1(72.42,34.09) 78.33,34.09 78.64,33.78 78.64,27.86 78.97,27.53 80.33,27.53 U7.9 84.24,27.55 84.46,27.76 84.46,28.86 R9.1 85.25,28.92 85.47,29.13 85.47,39.7 85.25,39.93 R33.1 84.34,39.75 83.01,39.75 82.7,40.06 82.7,42.75 83.14,43.18 U4.5 84.78,43.15 v1(86.23,43.15)
  Bottom Layer w0.305: v1(33.15,34.09) v1(72.42,34.09)
SEG_A: length 59.4
  Top Layer w0.305: R11.1 25.15,78.79 25.45,79.1 70.79,79.1 71.22,78.66 71.22,77.65 LED1.11
SEG_B: length 70.9
  Top Layer w0.305: R12.1 v1(20.95,74.45)
  Bottom Layer w0.305: LED1.7 81.35,74.97 80.82,74.45 v1(20.95,74.45)
SEG_C: length 72.8
  Top Layer w0.305: v1(76.25,71.22) 76.27,71.2 LED1.4 ; R14.1 v1(16.76,71.25)
  Bottom Layer w0.305: v1(16.76,71.25) 76.23,71.25 v1(76.25,71.22)
SEG_COM1: length 3.6
  Top Layer w0.305: R20.2 43.18,64.82 JP1.2
SEG_COM2: length 17.9
  Top Layer w0.305: JP2.2 43.21,57.53 45.06,57.53 45.49,57.96 45.49,65.43 45.11,65.81 38.79,65.81 38.48,65.51 R21.2
SEG_COM3: length 20.9
  Top Layer w0.305: 28.62,51.4 27.26,51.4 v1(27.23,51.44) ; R22.2 33.81,64.84 33.81,62.84 33.5,62.53 27.97,62.53 27.38,61.95 v1(27.38,58.24)
  Bottom Layer w0.305: v1(27.38,58.24) 27.38,51.59 v1(27.23,51.44)
SEG_COM4: length 19
  Top Layer w0.305: U6.18 26.53,50.13 v1(26.52,50.11) ; R23.2 29.24,64.39 29.16,64.31 29.16,63.68 28.73,63.25 27.13,63.25 26.54,62.66 v1(26.54,59.11)
  Bottom Layer w0.305: v1(26.52,50.11) 26.52,59.08 v1(26.54,59.11)
SEG_D: length 73.8
  Top Layer w0.305: R15.1 v1(12.57,72.19) ; LED1.2 71.25,62.44 v1(71.25,72.16)
  Bottom Layer w0.305: v1(71.25,72.16) 71.22,72.19 v1(12.57,72.19)
SEG_DP: length 53.1
  Top Layer w0.305: R19.2 74.12,38.91 v1(74.14,38.94)
  Bottom Layer w0.305: LED1.3 74.14,61.97 v1(74.14,38.94)
SEG_E: length 77.6
  Top Layer w0.305: LED1.1 68.63,62.4 v1(68.63,73.18) ; R16.1 8.38,73.23 v1(8.33,73.28)
  Bottom Layer w0.305: v1(68.63,73.18) 68.53,73.28 v1(8.33,73.28)
SEG_F: length 85.3
  Top Layer w0.305: R17.1 4.19,79.65 4.9,80.37 73.28,80.37 73.86,79.78 73.86,77.75 LED1.10
SEG_G: length 59.6
  Top Layer w0.305: R18.2 v1(78.49,36.75)
  Bottom Layer w0.305: v1(78.49,36.75) 78.49,62.06 LED1.5
TXD: length 32.6
  Top Layer w0.305: R29.2 13.32,52.67 U6.16 31.26,52.67 31.72,53.14 31.72,57.33 32.28,57.89 40.26,57.89 JP2.1
XTAL1: length 8.6
  Top Layer w0.305: U6.10 38.53,48.61 38.63,48.51 40.08,48.51 C2.1 45.91,50.73 45.95,50.76
XTAL2: length 8.7
  Top Layer w0.305: U6.9 38.53,47.95 38.63,48.05 40.08,48.05 C1.1 45.91,45.83 X1.2
$1N364: length 51.2
  Top Layer w0.305: 28.64,37.43 5.44,37.43 4.11,38.76 v1(4.11,48.41) ; v1(4.17,59.84) 4.17,64.87 R17.2
  Bottom Layer w0.305: v1(4.11,48.41) 4.11,59.79 v1(4.17,59.84)
$1N365: length 46.1
  Top Layer w0.305: R16.2 8.46,64.82 v1(8.46,59.84) ; 28.62,38.7 8.97,38.7 8.46,39.22 v1(8.46,48.41)
  Bottom Layer w0.305: v1(8.46,59.84) v1(8.46,48.41)
$1N366: length 40.5
  Top Layer w0.305: v1(12.7,48.41) 12.7,40.72 13.44,39.97 U6.26 ; v1(12.75,59.84) 12.75,64.72 R15.2
  Bottom Layer w0.305: v1(12.7,48.41) 12.75,48.46 v1(12.75,59.84)
$1N367: length 35.7
  Top Layer w0.305: v1(16.41,48.39) 16.41,41.88 17.05,41.24 28.62,41.24 ; R14.2 16.36,64.49 v1(16.36,59.87)
  Bottom Layer w0.305: v1(16.36,59.87) 16.41,59.82 v1(16.41,48.39)
$1N368: length 29.8
  Top Layer w0.305: R12.2 20.95,60.05 v1(20.83,59.92) ; U6.24 21.57,42.51 20.83,43.26 v1(20.83,48.39)
  Bottom Layer w0.305: v1(20.83,48.39) v1(20.83,59.92)
$1N369: length 24.2
  Top Layer w0.305: R11.2 25.3,64.74 v1(25.3,59.89) ; v1(25.27,48.41) 25.2,48.34 25.2,44.48 25.89,43.78 U6.23
  Bottom Layer w0.305: v1(25.27,48.41) 25.27,59.87 v1(25.3,59.89)
$1N370: length 4.5
  Top Layer w0.305: 38.38,38.65 42.2,38.65 arc(42.5,38.77) 42.62,39.06
$1N371: length 4.7
  Top Layer w0.305: 38.46,37.23 38.63,37.4 42.04,37.4 42.21,37.23 arc(42.55,37.09) R18.1
$1N483: length 4.1
  Top Layer w0.305: R20.1 Q1.2
$1N492: length 4.1
  Top Layer w0.305: Q2.2 38.49,66.83 R21.1
$1N524: length 4.1
  Top Layer w0.305: Q3.2 33.87,66.84 R22.1
$1N556: length 4.1
  Top Layer w0.305: Q4.2 29.25,66.84 R23.1
$1N635: length 4.2
  Top Layer w0.305: R25.1 62.94,11.4
$1N636: length 4.2
  Top Layer w0.305: 70.85,11.4 R26.1
$1N802: length 8.7
  Top Layer w0.305: H1.3 R28.1
$1N805: length 8.7
  Top Layer w0.305: R29.1 2.41,52.99
$1N952: length 51.9
  Top Layer w2.286: B1.1 97,16.92 arc(97.48,15.77) 98.63,15.29 101.29,15.29 arc(102.26,15.69) 102.67,16.66 102.67,52.15 arc(102.38,52.85) 101.68,53.14 96.3,53.14 arc(96.29,53.13) D1.2
$1N955: length 16.5
  Top Layer w1.27: C15.1 91.7,46.99 U4.8 84.72,47.02 D2.1
  Top Layer w2.286: D2.1 D1.1
$1N968: length 4.4
  Top Layer w0.305: X2.2 76.44,47.39 77.23,46.61 79.27,46.61 79.34,46.67 U4.1
$1N969: length 6.3
  Top Layer w0.305: U4.2 79.34,46.08 79.27,46.15 77.23,46.15 76.44,45.36 X2.1 75.59,43.52
$1N1047: length 4.2
  Top Layer w0.305: 55.03,11.4 R24.1
$1N1134: length 4.3
  Top Layer w0.305: R34.1 74.06,24.64 arc(74.12,24.61) U7.5
$1N1144: length 5.2
  Top Layer w0.305: U7.4 70.11,25.55 69.9,25.76 69.9,26.54 69.93,26.57
$1N1149: length 16.2
  Top Layer w0.305: v1(88.11,32.51) 86.53,32.51 R8.2 ; R10.2 86.41,21.08 86.66,20.83 87.81,20.83 88.06,21.08 88.06,27.41 v1(88.11,27.46)
  Bottom Layer w0.305: v1(88.11,32.51) v1(88.11,27.46)
$1N1177: length 7.6
  Top Layer w0.305: U7.7 82.67,25.55 82.93,25.81 86.11,25.81 86.41,25.5 R10.1
$1N1209: length 12.3
  Top Layer w0.305: R35.1 C16.1 66.47,26.9 66.47,27.46 66.56,27.55 U7.2
$1N3634: length 12
  Top Layer w1.524: P1.1 99.91,12.45 91.01,12.45 90.68,12.12 R7.2
$1N3652: length 7.9
  Top Layer w0.305: U3.3 C7.2 R7.1

## Copper pours and planes (outline as drawn; the poured copper is in the pictures)
GND on Top Layer: -11.43,95.58 121.34,95.58 121.34,-9.42 -11.43,-9.42
GND on Bottom Layer: -8.51,97.23 127.66,97.23 127.66,-19.96 -8.51,-19.96
VDD on Top Layer: 32.4,25.76 38.02,25.76 38.02,23.83 32.4,23.83
VDD on Top Layer: 17.83,26.66 38.02,26.66 38.02,24.79 17.83,24.79
VDD on Top Layer: 31.67,9.02 78.61,9.02 78.61,4.1 31.67,4.1
VDD on Top Layer: 79.3,25.48 84.77,25.48 84.77,23.52 79.3,23.52
ADC_IN on Top Layer: 81.48,6.9 83.96,6.9 83.96,4.71 81.48,4.71
DC on Top Layer: 12.88,9.83 31.01,9.83 31.01,4.6 12.88,4.6
LOW_PWR on Top Layer: 50.64,55.91 59.54,55.91 59.54,54.08 50.64,54.08
$1N209 on Top Layer: 0.86,26.66 17.6,26.66 17.6,17.1 0.86,17.1
$1N230 on Top Layer: 1.04,37.09 17.55,37.09 17.55,28.24 1.04,28.24

Small or netless copper shapes (teardrops, artwork), in the pictures only: 222 on Top Layer, 51 on Bottom Layer

## Text on the board
Top Silkscreen Layer: GND | RXD | TXD | VDD
